# Altium project dirver2.PrjPCB
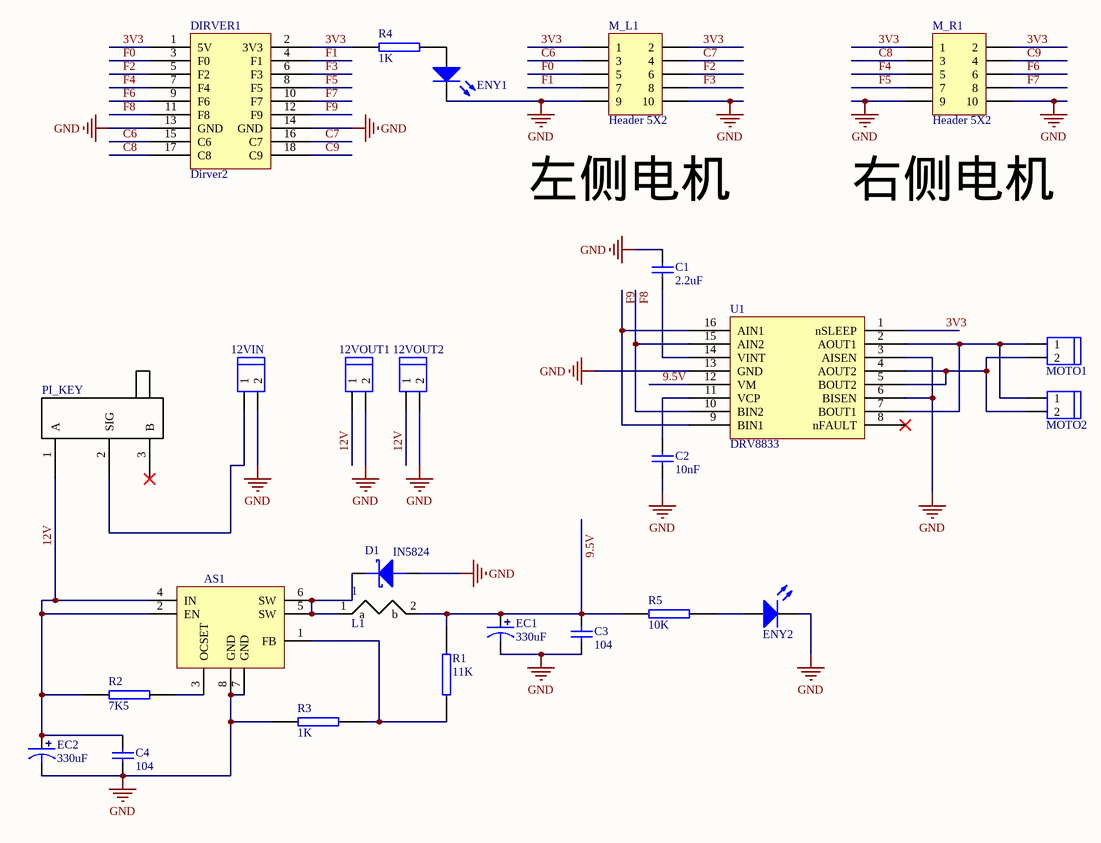
[diagram p0: dirver2.SchDoc]
1 sheet, 26 parts. Net scope: global (net labels, ports and power ports of the same name join across sheets).
Board file: dirver3.PcbDoc

## Sheet dirver2.SchDoc
size A4

### Parts
1  L1  [INDUCTOR]
12VIN  HEAD2  [HEAD2L-0.8]  (value not drawn)
12VOUT1  HEAD2  [HEAD2L-0.8]  (value not drawn)
12VOUT2  HEAD2  [HEAD2L-0.8]  (value not drawn)
AS1  U1  [AS1015]  (value not drawn)
C1  Cap  [CAP[0805]]  (value not drawn)
C2  Cap  [CAP[0805]]  (value not drawn)
C3  Cap  [CAP[0805]]  (value not drawn)
C4  Cap  [CAP[0805]]  (value not drawn)
D1  IN5824  [SMA/DO-214AC]
DIRVER1  Dirver2  [DIRVER2]
EC1  330uF  [DIP-EC5.0X10X12.5]
EC2  330uF  [DIP-EC5.0X10X12.5]
ENY1  LED0  [LED[0805]]  (value not drawn)
ENY2  LED0  [LED[0805]]  (value not drawn)
M_L1  Header 5X2  [HDR2X5]
M_R1  Header 5X2  [HDR2X5]
MOTO1  HEAD2  [HEAD2L-0.8]  (value not drawn)
MOTO2  HEAD2  [HEAD2L-0.8]  (value not drawn)
PI_KEY1  PI_KEY  [KEY]
R1  11K  [R0805]
R2  7K5  [R0805]
R3  1K  [R0805]
R4  1K  [R0805]
R5  10K  [R0805]
U1  DRV8833  [DRV8833]

### Nets
GND: 12VIN.2 12VOUT1.2 12VOUT2.2 AS1.7(GND) AS1.8(GND) C1.2 C2.1 C3.1 C4.1 D1.A DIRVER1.13(GND) DIRVER1.14(GND) EC1.2 EC2.2 ENY1.2(K) ENY2.2(K) M_L1.9 M_L1.10 M_R1.9 M_R1.10 R3.2 U1.3(AISEN) U1.6(BISEN) U1.13(GND)
3V3: DIRVER1.1(5V) DIRVER1.2(3V3) M_L1.1 M_L1.2 M_R1.1 M_R1.2 R4.2 U1.1(nSLEEP)
9.5V: 1.2(b) C3.2 EC1.1 R1.2 R5.2 U1.12(VM)
12V: 12VOUT1.1 12VOUT2.1 AS1.2(EN) AS1.4(IN) C4.2 EC2.1 PI_KEY1.1(A) R2.1
C6: DIRVER1.15(C6) M_L1.3
C7: DIRVER1.16(C7) M_L1.4
C8: DIRVER1.17(C8) M_R1.3
C9: DIRVER1.18(C9) M_R1.4
F0: DIRVER1.3(F0) M_L1.5
F1: DIRVER1.4(F1) M_L1.7
F2: DIRVER1.5(F2) M_L1.6
F3: DIRVER1.6(F3) M_L1.8
F4: DIRVER1.7(F4) M_R1.5
F5: DIRVER1.8(F5) M_R1.7
F6: DIRVER1.9(F6) M_R1.6
F7: DIRVER1.10(F7) M_R1.8
F8: DIRVER1.11(F8) U1.10(BIN2) U1.15(AIN2)
F9: DIRVER1.12(F9) U1.9(BIN1) U1.16(AIN1)
Net1_1: 1.1(a) AS1.5(SW) AS1.6(SW) D1.K
Net12VIN_1: 12VIN.1 PI_KEY1.2(SIG)
NetAS1_1: AS1.1(FB) R1.1 R3.1
NetAS1_3: AS1.3(OCSET) R2.2
NetC1_1: C1.1 U1.14(VINT)
NetC2_2: C2.2 U1.11(VCP)
NetENY1_1: ENY1.1(A) R4.1
NetENY2_1: ENY2.1(A) R5.1
NetMOTO1_1: MOTO1.1 MOTO2.1 U1.2(AOUT1) U1.7(BOUT1)
NetMOTO1_2: MOTO1.2 MOTO2.2 U1.4(AOUT2) U1.5(BOUT2)

Not connected (* = marked no-connect by the designer): PI_KEY1 3(B)*; U1 8(nFAULT)*

### Notes on the sheet
- 左侧电机
- (near M_R1) 右侧电机
- (in symbol Cap) 2.2uF; 10nF; 104

### Library data of the parts
1 = INDUCTOR
AS1 = LED2
D1 = DIODE SCHOTTKY: 肖特基二极管
EC1 EC2 = DIP_ECAP: 直插电解电容
M_L1 M_R1 = Header 5X2: Header, 5-Pin, Dual row; LatestRevisionDate: 17-Jul-2002; LatestRevisionNote: Re-released for DXP Platform.; Publisher: Altium Limited
PI_KEY1 = key
R1-R5 = RES